# EAGLE design SSOT_Breakout_Solar (EAGLE 7.1.0)
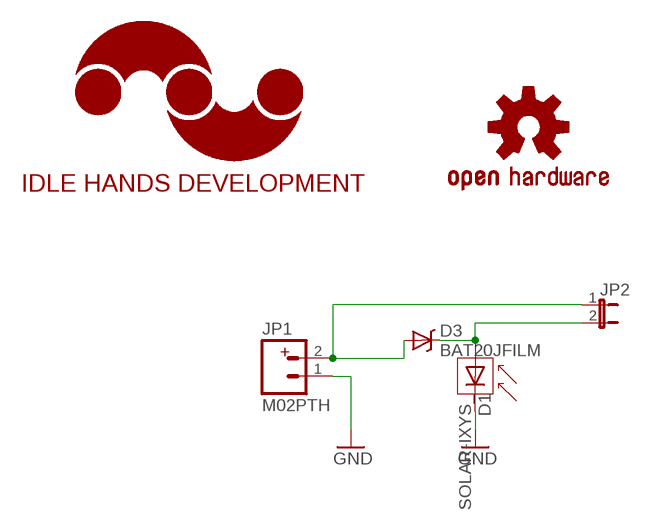
[diagram p0: schematic, sheet 1]

## Parts
D1  SOLAR-IXYS_  [SO08]
D3  BAT20JFILM  [SOD-323]
JP1  M02PTH  [1X02]
JP2  JUMPER-2SMD-NO  [SJ_2S-NO]
LOGO1  IDLEHANDS_LOGOS  [IHD-LOGO-S]
LOGO2  OSHW-LOGOS  [OSHW-LOGO-S]

## Nets
GND: D1.5(C) JP1.1
INC: D1.8(A) D3.1(C) JP2.2
INO: D3.2(A) JP1.2 JP2.1

## Library data of the parts
D1 = SparkFun-Sensors:SOLAR-IXYS
D3 = SparkFun-DiscreteSemi:BAT20JFILM: 23V, 1A Schottky diode, SOD-323 package; PROD_ID: DIO-11623
JP1 = SparkFun-Connectors:M02: Standard 2-pin 0.1" header. Use with - straight break away headers ( PRT-00116) - right angle break away headers (PRT-00553) - swiss pins (PRT-00743) - machine pins (PRT-00117) - female headers (PRT-00115) Molex polarized connector foot print use with: PRT-08233 with associated crimp pins and housings. 2.54_SCREWTERM for use with PRT-10571. 3.5mm Screw Terminal footprints for PRT-08084 5mm Screw Terminal footprints for use with PRT-08433
JP2 = SparkFun-Passives:JUMPER-2: Jumper Basic 0.1" spaced jumper. Use with breakaway headers.
LOGO1 = IdleHandsProject:IDLEHANDS_LOGO: Open Source Hardware Logo This logo indicates the piece of hardware it is found on incorporates a OSHW license and/or adheres to the definition of open source hardware found here: http://freedomdefined.org/OSHW
LOGO2 = SparkFun-Aesthetics:OSHW-LOGO: Open Source Hardware Logo This logo indicates the piece of hardware it is found on incorporates a OSHW license and/or adheres to the definition of open source hardware found here: http://freedomdefined.org/OSHW

## Board
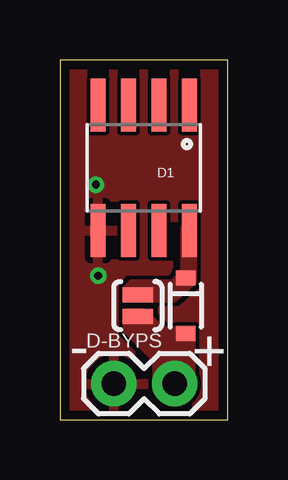
[diagram p1: board, top side]
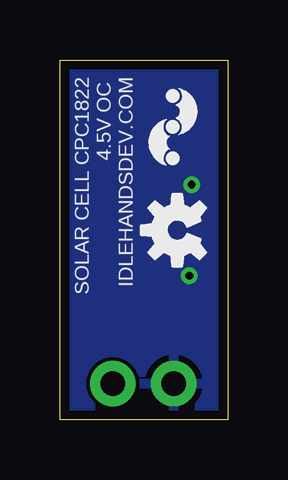
[diagram p2: board, bottom side, seen from below]

Size 7 x 15 mm. Coordinates in mm from the lower left corner, seen from the top.
Outline: 0,0 7,0 7,15 0,15 0,0
Copper layers (1*16): Top 0.0356mm / dielectric 1.5011mm / Bottom 0.0356mm
Design rules "LaenPCBOrder": minimum track width 6mil, minimum drill 13mil, track to track 6mil, track to pad 6mil, pad to pad 6mil, via to via 6mil, smd to smd 6mil, copper to edge 15mil, drill to drill 6mil, minimum pad ring 7mil, minimum via ring 7mil, stop-mask expansion 3mil, vias tented up to drill 0mil, thermal gap 10mil

### Footprints (pad centres in the part's own frame; a part is rotated, then mirrored left to right if it is on the bottom)
SO08 = smd 0.61 x 2.21: 1 -1.905,-2.616; 2 -0.635,-2.616; 3 0.635,-2.616; 4 1.905,-2.616; 5 1.905,2.616; 6 0.635,2.616; 7 -0.635,2.616; 8 -1.905,2.616
SOD-323 = smd 0.63 x 0.83: 1 -1.15,0; 2 1.15,0
1X02 = drill 1.016 pad 1.88: 1 0,0; 2 2.54,0
SJ_2S-NO = smd 0.635 x 1.27: 1 -0.45,0; 2 0.45,0

### Placement (x,y rotation side)
D1  3.5,10.5 180 top
D3  5.25,4.75 270 top
JP1  2.25,1.5 0 top
JP2  3.25,4.75 90 top
LOGO1  2.3,12.2 270 bottom
LOGO2  2.1,7.9 90 bottom

### Tracks (layer width: path | path; a pad name or v marks a point on that pad's centre or on a via)
GND  (via drill 0.33)
  other vias: 1.6,6 1.5,9.8
  pour Bottom (rank 6): 0,0 0,15 7,15 7,0
  pour Top (rank 6): 0,0 0,15 7,15 7,0
INC
  pour Top (no thermals): 2.75,5 2.75,5.5 3,5.75 4.75,5.75 5.15,6.25 5.15,8 5.6,8 5.6,5.75 4.75,5
INO
  pour Top (no thermals): 4,1.25 4,2.5 2.75,3.75 2.75,4.5 3.5,4.5 4.25,3.75 5.5,3.75 5.5,1.25

### Text on the board
tNames: D-BYPS | - | +
bNames: SOLAR CELL CPC1822 / 4.5V OC / IDLEHANDSDEV.COM